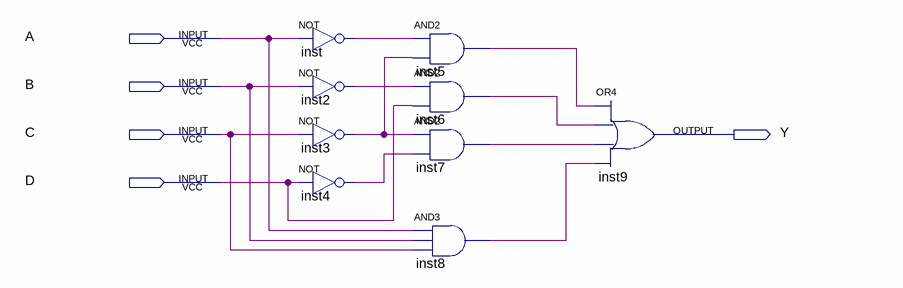
[diagram p0: schematic sheet]
// Quartus schematic s1113341_lab04_1.bdf as structural Verilog: 9 symbols, 5 pins
module s1113341_lab04_1 (
  input  A,
  input  B,
  input  C,
  input  D,
  output Y
);

  wire inst2_out, inst3_out, inst4_out, inst5_out, inst6_out, inst7_out, inst8_out, inst_out;

  not inst (inst_out, A);
  not inst2 (inst2_out, B);
  not inst3 (inst3_out, C);
  not inst4 (inst4_out, D);
  and inst5 (inst5_out, inst_out, inst3_out);
  and inst6 (inst6_out, inst2_out, D);
  and inst7 (inst7_out, inst3_out, inst4_out);
  and inst8 (inst8_out, A, B, C);
  or inst9 (Y, inst5_out, inst6_out, inst7_out, inst8_out);
endmodule
